# Altium project 2012_PerfUSB.PrjPCB
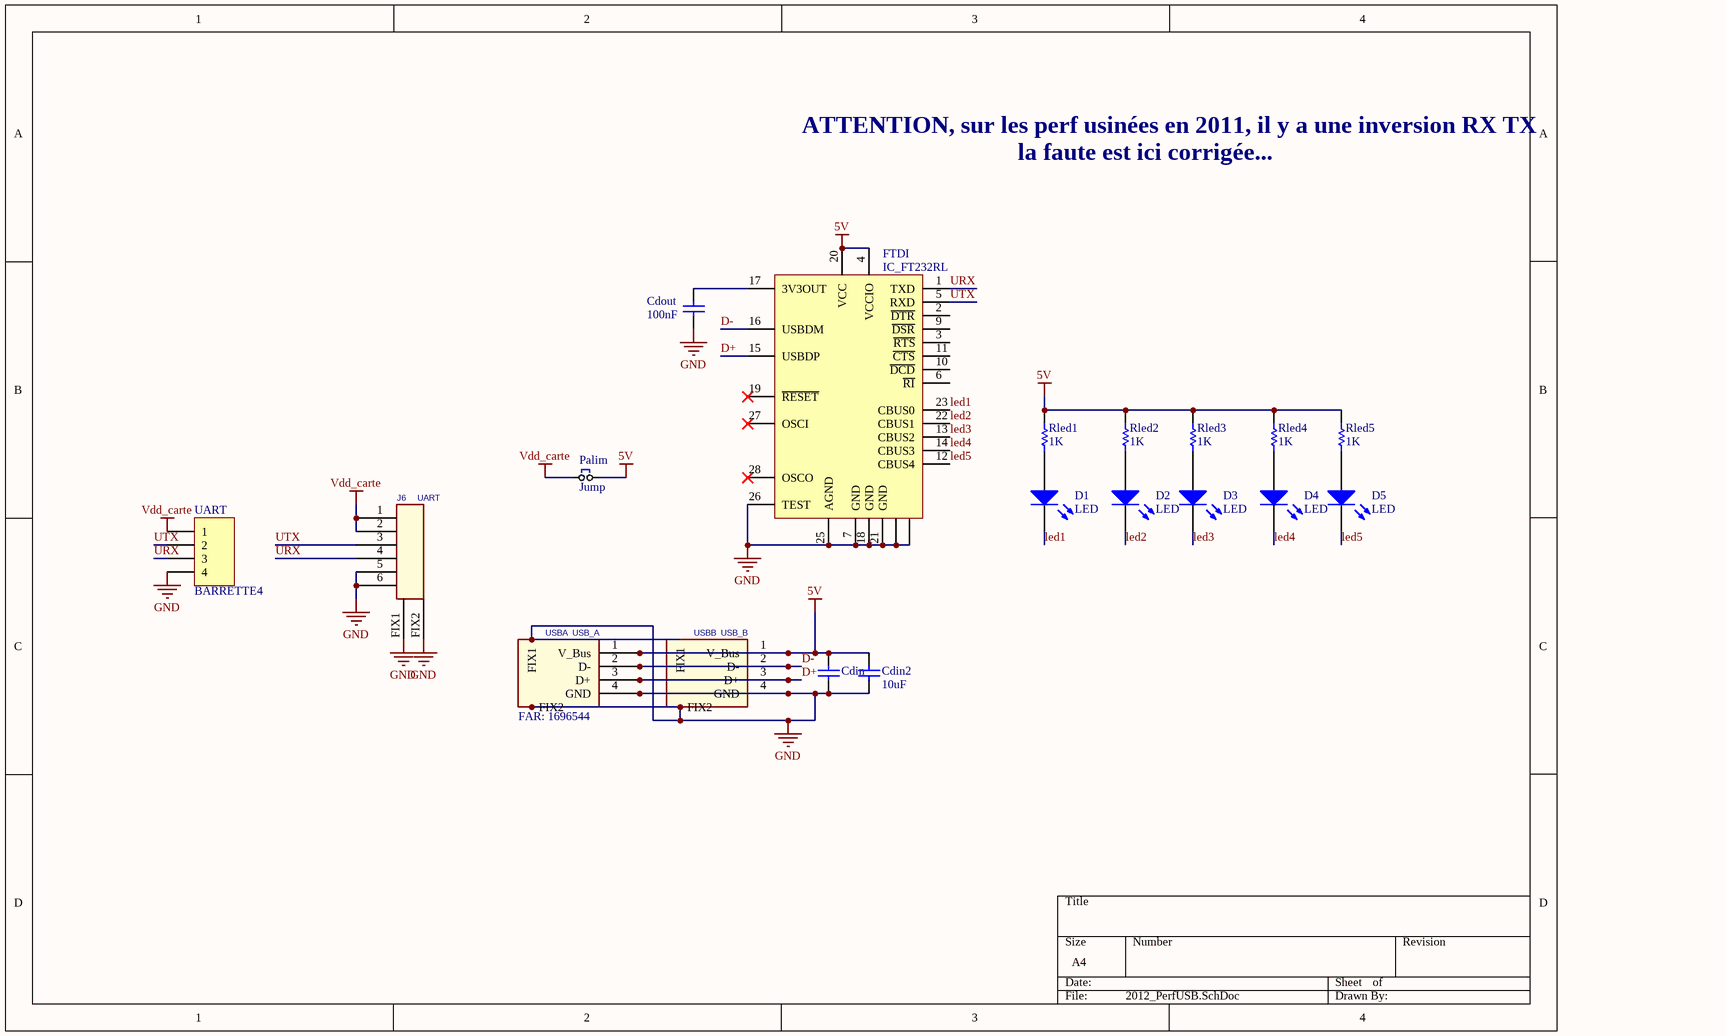
[diagram p0: 2012_PerfUSB.SchDoc]
1 sheet, 19 parts. Net scope: global (net labels, ports and power ports of the same name join across sheets).
Board file: 2012_PerfUSB.PcbDoc

## Sheet 2012_PerfUSB.SchDoc
size A4

### Parts
Cdin  100nF  [C0603_N]  (value not drawn)
Cdin2  10uF  [C1206_N]
Cdout  100nF  [C0603_N]
D1  LED  [LED_0805]
D2  LED  [LED_0805]
D3  LED  [LED_0805]
D4  LED  [LED_0805]
D5  LED  [LED_0805]
FTDI  IC_FT232RL  [SSOP28_N]
J6  UART  [RJ11_6/6]
Palim  Jump  [HDR1X2]
Rled1  1K  [R1206_N]
Rled2  1K  [R1206_N]
Rled3  1K  [R1206_N]
Rled4  1K  [R1206_N]
Rled5  1K  [R1206_N]
UART  BARRETTE4  [HDR1X4]
USBA  USB_A  FAR: 1696544  [USB_A_COUDE - FAR1696544]
USBB  USB_B  [USB_B_COUDE]

### Nets
5V: Cdin.2 Cdin2.2 FTDI.4(VCCIO) FTDI.20(VCC) Palim.2 Rled1.2 Rled2.2 Rled3.2 Rled4.2 Rled5.2 USBA.1(V_Bus) USBB.1(V_Bus)
GND: Cdin.1 Cdin2.1 Cdout.1 FTDI.7(GND) FTDI.8(NC) FTDI.18(GND) FTDI.21(GND) FTDI.24(NC) FTDI.25(AGND) FTDI.26(TEST) J6.5 J6.6 J6.FIX1 J6.FIX2 UART.4 USBA.4(GND) USBA.FIX1 USBA.FIX2 USBB.4(GND) USBB.FIX1 USBB.FIX2
Vdd_carte: J6.1 J6.2 Palim.1 UART.1
D+: FTDI.15(USBDP) USBA.3(D+) USBB.3(D+)
D-: FTDI.16(USBDM) USBA.2(D-) USBB.2(D-)
led1: D1.2 FTDI.23(CBUS0)
led2: D2.2 FTDI.22(CBUS1)
led3: D3.2 FTDI.13(CBUS2)
led4: D4.2 FTDI.14(CBUS3)
led5: D5.2 FTDI.12(CBUS4)
URX: FTDI.1(TXD) J6.4 UART.3
UTX: FTDI.5(RXD) J6.3 UART.2
NetCdout_2: Cdout.2 FTDI.17(3V3OUT)
NetD1_1: D1.1 Rled1.1
NetD2_1: D2.1 Rled2.1
NetD3_1: D3.1 Rled3.1
NetD4_1: D4.1 Rled4.1
NetD5_1: D5.1 Rled5.1

Not connected (* = marked no-connect by the designer): FTDI 2(~{DTR}) 3(~{RTS}) 6(~{RI}) 9(~{DSR}) 10(~{DCD}) 11(~{CTS}) 19(~{RESET})* 27(OSCI)* 28(OSCO)*

### Notes on the sheet
- ATTENTION, sur les perf usinées en 2011, il y a une inversion RX TX
- la faute est ici corrigée...

### Library data of the parts
Cdin Cdout = Capacitor: FAR: 1740614; Published: 01/01/10; LatestRevisionDate: 17-Jul-2002; LatestRevisionNote: Re-released for DXP Platform.; Publisher: Damien GUITTON
Cdin2 = Capacitor: Published: 8-Jun-2000; LatestRevisionDate: 17-Jul-2002; LatestRevisionNote: Re-released for DXP Platform.; PackageReference: RAD-0.3; Publisher: Altium Limited
D1-D5 = LED: Typical LED; Published: 8-Jun-2000; LatestRevisionDate: 08-Jul-2005; LatestRevisionNote: Mech Layer 1 removed.; PackageReference: LED-1; Publisher: Altium Limited
FTDI = IC_FT232RL: FT232R USB UART; Manufacturer: *; Note: *; ManufacturerPartNo: *
J6 = CONNECTEUR_RJ12
Palim = Jumper SIP2.54
Rled1-Rled5 = Resistor: Published: 8-Jun-2000; LatestRevisionDate: 17-Jul-2002; LatestRevisionNote: Re-released for DXP Platform.; PackageReference: AXIAL-0.5; Publisher: Altium Limited
UART = BARRETTE4: Header, 4-Pin; LatestRevisionDate: 17-Jul-2002; LatestRevisionNote: Re-released for DXP Platform.; Publisher: Altium Limited
USBA = USB_B: FAR1696544